# Altium schematic sheet Sheet1.SchDoc
size A3; SheetNumber: 3; SheetTotal: 3
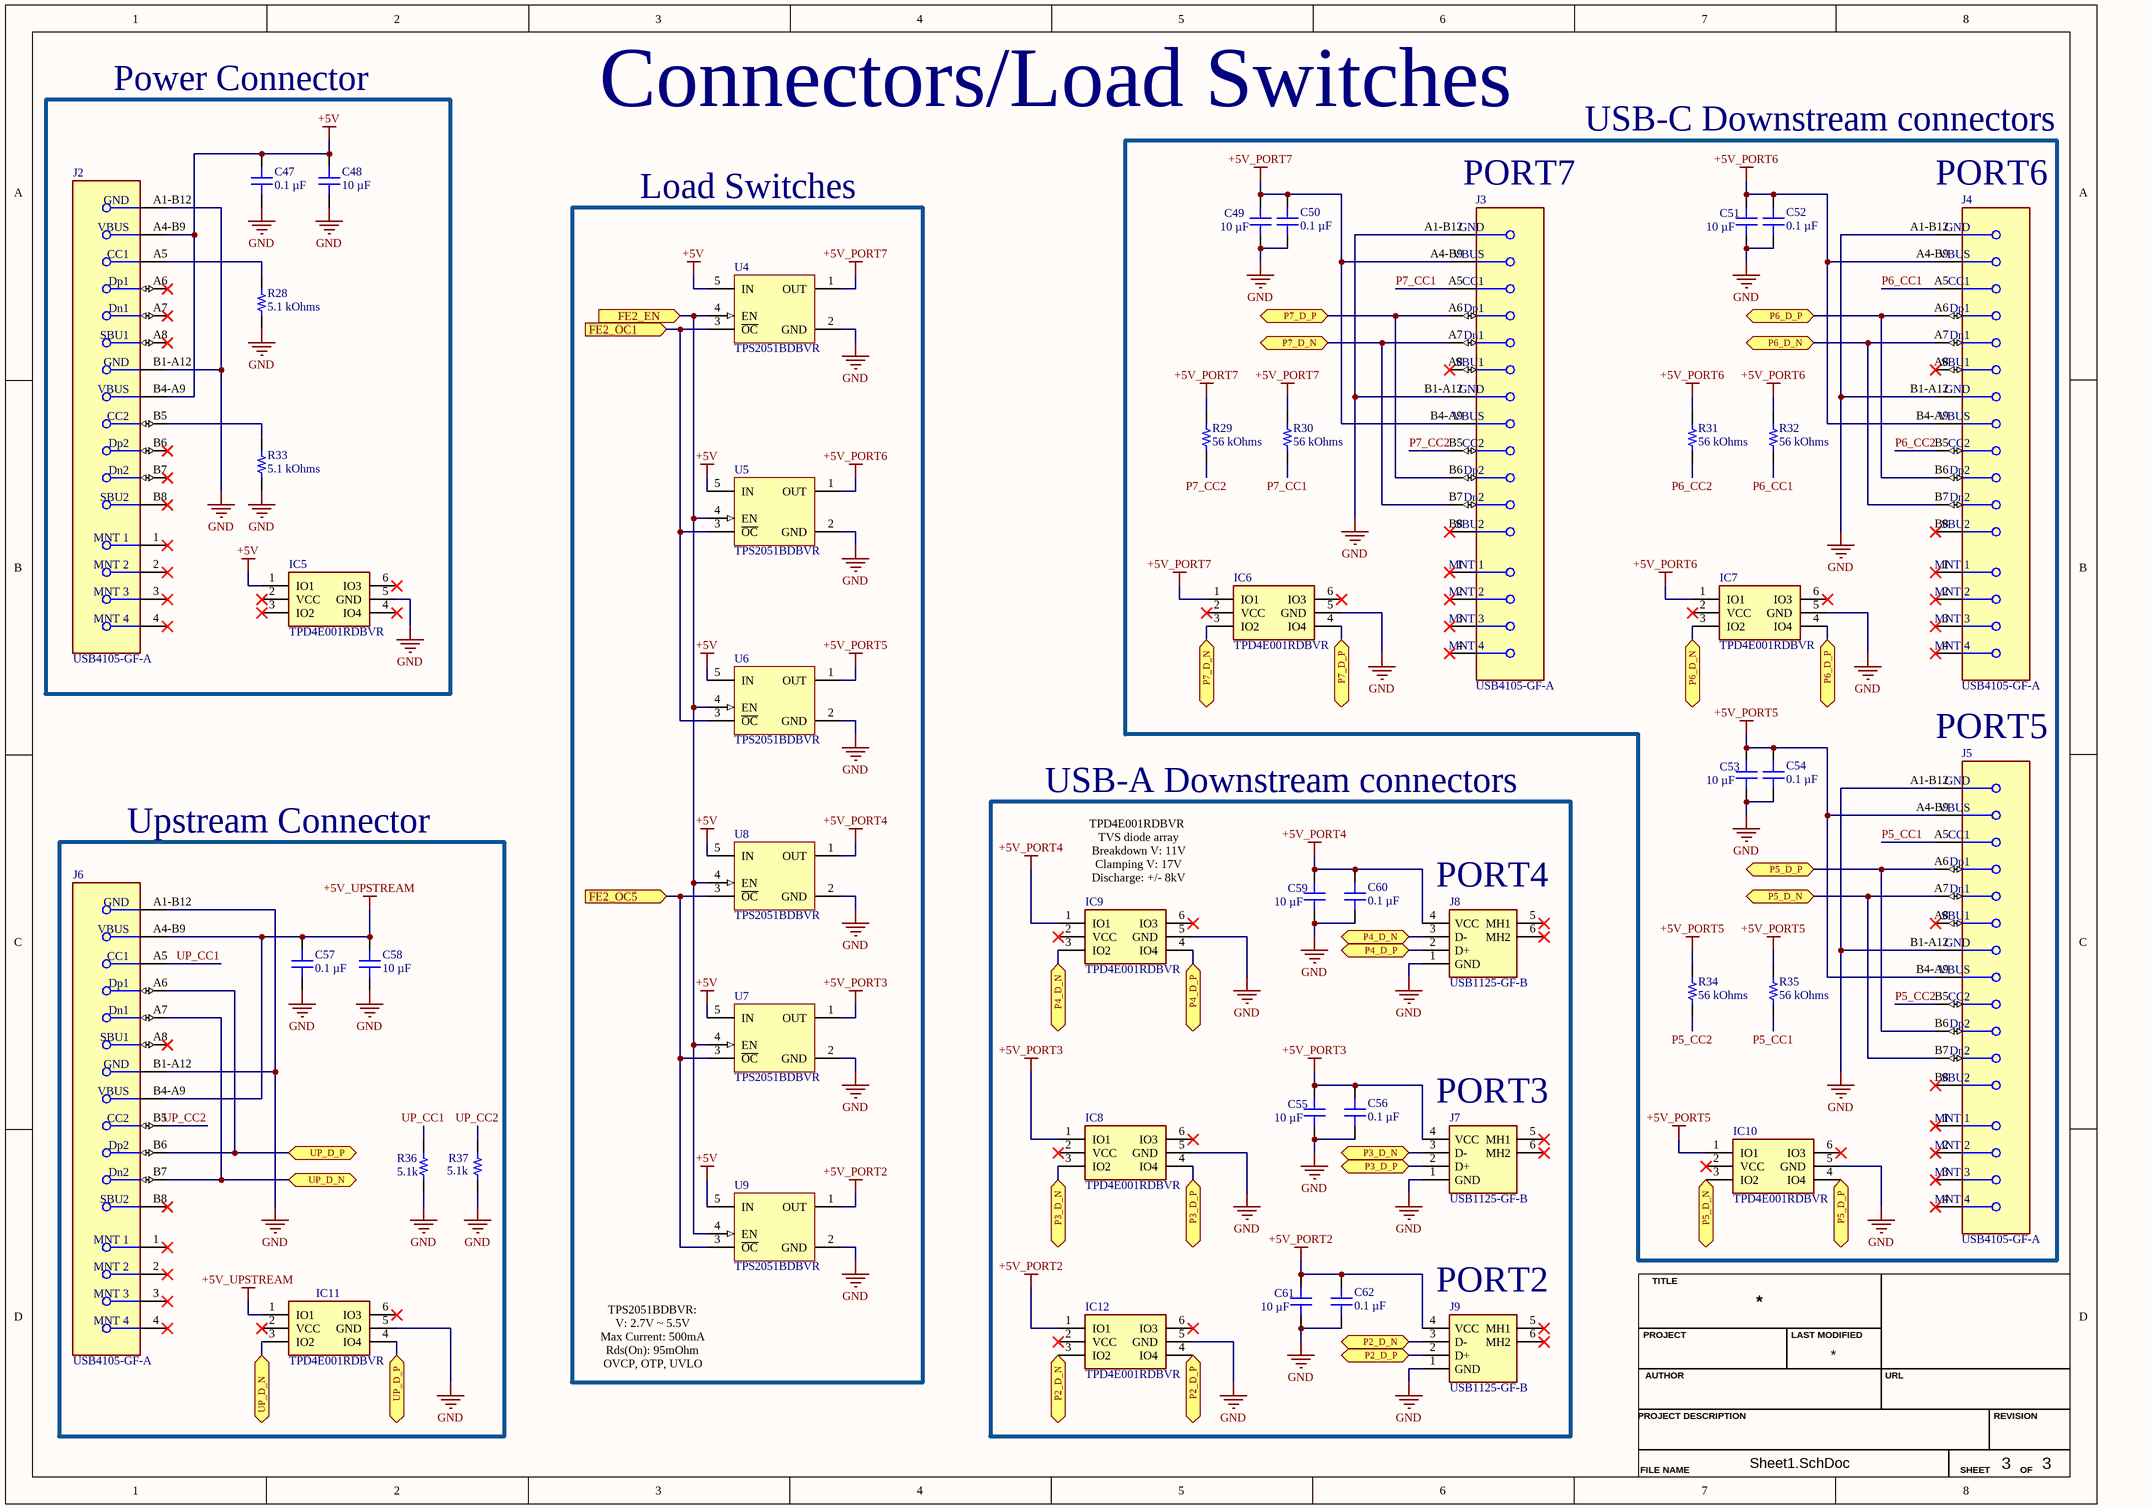
[diagram p0: Sheet1.SchDoc]

## Parts
C47  0.1 µF  [CAP 0603_1608]
C48  10 µF  [MURATA GRM21B 0805_2012]
C49  10 µF  [MURATA GRM21B 0805_2012]
C50  0.1 µF  [CAP 0603_1608]
C51  10 µF  [MURATA GRM21B 0805_2012]
C52  0.1 µF  [CAP 0603_1608]
C53  10 µF  [MURATA GRM21B 0805_2012]
C54  0.1 µF  [CAP 0603_1608]
C55  10 µF  [MURATA GRM21B 0805_2012]
C56  0.1 µF  [CAP 0603_1608]
C57  0.1 µF  [CAP 0603_1608]
C58  10 µF  [MURATA GRM21B 0805_2012]
C59  10 µF  [MURATA GRM21B 0805_2012]
C60  0.1 µF  [CAP 0603_1608]
C61  10 µF  [MURATA GRM21B 0805_2012]
C62  0.1 µF  [CAP 0603_1608]
IC5  TPD4E001RDBVR  [SOT95P280X145-6N]
IC6  TPD4E001RDBVR  [SOT95P280X145-6N]
IC7  TPD4E001RDBVR  [SOT95P280X145-6N]
IC8  TPD4E001RDBVR  [SOT95P280X145-6N]
IC9  TPD4E001RDBVR  [SOT95P280X145-6N]
IC10  TPD4E001RDBVR  [SOT95P280X145-6N]
IC11  TPD4E001RDBVR  [SOT95P280X145-6N]
IC12  TPD4E001RDBVR  [SOT95P280X145-6N]
J2  USB4105-GF-A  [FP-USB4105-GF-A-MFG]
J3  USB4105-GF-A  [FP-USB4105-GF-A-MFG]
J4  USB4105-GF-A  [FP-USB4105-GF-A-MFG]
J5  USB4105-GF-A  [FP-USB4105-GF-A-MFG]
J6  USB4105-GF-A  [FP-USB4105-GF-A-MFG]
J7  USB1125-GF-B  [USB1125GFB]
J8  USB1125-GF-B  [USB1125GFB]
J9  USB1125-GF-B  [USB1125GFB]
R28  5.1 kOhms  [KOA RES RK73 RN73 0603_1608]
R29  56 kOhms  [YAGEO RES 0603_1608]
R30  56 kOhms  [YAGEO RES 0603_1608]
R31  56 kOhms  [YAGEO RES 0603_1608]
R32  56 kOhms  [YAGEO RES 0603_1608]
R33  5.1 kOhms  [KOA RES RK73 RN73 0603_1608]
R34  56 kOhms  [YAGEO RES 0603_1608]
R35  56 kOhms  [YAGEO RES 0603_1608]
R36  5.1k  [KOA RES RK73 RN73 0603_1608]
R37  5.1k  [KOA RES RK73 RN73 0603_1608]
U4  TPS2051BDBVR  [DBV0005A_L]
U5  TPS2051BDBVR  [DBV0005A_L]
U6  TPS2051BDBVR  [DBV0005A_L]
U7  TPS2051BDBVR  [DBV0005A_L]
U8  TPS2051BDBVR  [DBV0005A_L]
U9  TPS2051BDBVR  [DBV0005A_L]

## Blocks framed on the sheet
Power Connector: C47 C48 IC5 J2 R28 R33
Load Switches: U4-U9
Upstream Connector: C57 C58 IC11 J6 R36 R37

## Ports
FE2_EN (in), FE2_OC1 (in), FE2_OC5 (in), P2_D_N (bidir), P2_D_P (bidir), P3_D_N (bidir), P3_D_P (bidir), P4_D_N (bidir), P4_D_P (bidir), P5_D_N (bidir), P5_D_P (bidir), P6_D_N (bidir), P6_D_P (bidir), P7_D_N (bidir), P7_D_P (bidir), UP_D_N (bidir), UP_D_P (bidir)

## Nets
+5V: C47.2 C48.2 IC5.1(IO1) J2.A4-B9(VBUS) J2.B4-A9(VBUS) U4.5(IN) U5.5(IN) U6.5(IN) U7.5(IN) U8.5(IN) U9.5(IN)
+5V_PORT2: C61.2 C62.2 IC12.1(IO1) J9.4(VCC) U9.1(OUT)
+5V_PORT3: C55.2 C56.2 IC8.1(IO1) J7.4(VCC) U7.1(OUT)
+5V_PORT4: C59.2 C60.2 IC9.1(IO1) J8.4(VCC) U8.1(OUT)
+5V_PORT5: C53.2 C54.2 IC10.1(IO1) J5.A4-B9(VBUS) J5.B4-A9(VBUS) R34.2 R35.2 U6.1(OUT)
+5V_PORT6: C51.2 C52.2 IC7.1(IO1) J4.A4-B9(VBUS) J4.B4-A9(VBUS) R31.2 R32.2 U5.1(OUT)
+5V_PORT7: C49.2 C50.2 IC6.1(IO1) J3.A4-B9(VBUS) J3.B4-A9(VBUS) R29.2 R30.2 U4.1(OUT)
+5V_UPSTREAM: C57.2 C58.2 IC11.1(IO1) J6.A4-B9(VBUS) J6.B4-A9(VBUS)
GND: C47.1 C48.1 C49.1 C50.1 C51.1 C52.1 C53.1 C54.1 C55.1 C56.1 C57.1 C58.1 C59.1 C60.1 C61.1 C62.1 IC5.5(GND) IC6.5(GND) IC7.5(GND) IC8.5(GND) IC9.5(GND) IC10.5(GND) IC11.5(GND) IC12.5(GND) J2.A1-B12(GND) J2.B1-A12(GND) J3.A1-B12(GND) J3.B1-A12(GND) J4.A1-B12(GND) J4.B1-A12(GND) J5.A1-B12(GND) J5.B1-A12(GND) J6.A1-B12(GND) J6.B1-A12(GND) J7.1(GND) J8.1(GND) J9.1(GND) R28.1 R33.1 R36.1 R37.1 U4.2(GND) U5.2(GND) U6.2(GND) U7.2(GND) U8.2(GND) U9.2(GND)
FE2_EN: U4.4(EN) U5.4(EN) U6.4(EN) U7.4(EN) U8.4(EN) U9.4(EN) ; port FE2_EN
FE2_OC1: U4.3(~{OC}) U5.3(~{OC}) U6.3(~{OC}) ; port FE2_OC1
FE2_OC5: U7.3(~{OC}) U8.3(~{OC}) U9.3(~{OC}) ; port FE2_OC5
P2_D_N: IC12.3(IO2) J9.3(D-) ; port P2_D_N
P2_D_P: IC12.4(IO4) J9.2(D+) ; port P2_D_P
P3_D_N: IC8.3(IO2) J7.3(D-) ; port P3_D_N
P3_D_P: IC8.4(IO4) J7.2(D+) ; port P3_D_P
P4_D_N: IC9.3(IO2) J8.3(D-) ; port P4_D_N
P4_D_P: IC9.4(IO4) J8.2(D+) ; port P4_D_P
P5_CC1: J5.A5(CC1) R35.1
P5_CC2: J5.B5(CC2) R34.1
P5_D_N: IC10.3(IO2) J5.A7(Dn1) J5.B7(Dn2) ; port P5_D_N
P5_D_P: IC10.4(IO4) J5.A6(Dp1) J5.B6(Dp2) ; port P5_D_P
P6_CC1: J4.A5(CC1) R32.1
P6_CC2: J4.B5(CC2) R31.1
P6_D_N: IC7.3(IO2) J4.A7(Dn1) J4.B7(Dn2) ; port P6_D_N
P6_D_P: IC7.4(IO4) J4.A6(Dp1) J4.B6(Dp2) ; port P6_D_P
P7_CC1: J3.A5(CC1) R30.1
P7_CC2: J3.B5(CC2) R29.1
P7_D_N: IC6.3(IO2) J3.A7(Dn1) J3.B7(Dn2) ; port P7_D_N
P7_D_P: IC6.4(IO4) J3.A6(Dp1) J3.B6(Dp2) ; port P7_D_P
UP_CC1: J6.A5(CC1) R36.2
UP_CC2: J6.B5(CC2) R37.2
UP_D_N: IC11.3(IO2) J6.A7(Dn1) J6.B7(Dn2) ; port UP_D_N
UP_D_P: IC11.4(IO4) J6.A6(Dp1) J6.B6(Dp2) ; port UP_D_P
NetJ2_A5: J2.A5(CC1) R28.2
NetJ2_B5: J2.B5(CC2) R33.2

Not connected (* = marked no-connect by the designer): IC5 2(VCC)* 3(IO2)* 4(IO4)* 6(IO3)*; IC6 2(VCC)* 6(IO3)*; IC7 2(VCC)* 6(IO3)*; IC8 2(VCC)* 6(IO3)*; IC9 2(VCC)* 6(IO3)*; IC10 2(VCC)* 6(IO3)*; IC11 2(VCC)* 6(IO3)*; IC12 2(VCC)* 6(IO3)*; J2 1(MNT_1)* 2(MNT_2)* 3(MNT_3)* 4(MNT_4)* A6(Dp1)* A7(Dn1)* A8(SBU1)* B6(Dp2)* B7(Dn2)* B8(SBU2)*; J3 1(MNT_1)* 2(MNT_2)* 3(MNT_3)* 4(MNT_4)* A8(SBU1)* B8(SBU2)*; J4 1(MNT_1)* 2(MNT_2)* 3(MNT_3)* 4(MNT_4)* A8(SBU1)* B8(SBU2)*; J5 1(MNT_1)* 2(MNT_2)* 3(MNT_3)* 4(MNT_4)* A8(SBU1)* B8(SBU2)*; J6 1(MNT_1)* 2(MNT_2)* 3(MNT_3)* 4(MNT_4)* A8(SBU1)* B8(SBU2)*; J7 5(MH1)* 6(MH2)*; J8 5(MH1)* 6(MH2)*; J9 5(MH1)* 6(MH2)*

## Notes on the sheet
- Connectors/Load Switches
- USB-C Downstream connectors
- (near J3) PORT7
- (near J4) PORT6
- PORT5
- USB-A Downstream connectors
- (near IC9) TPD4E001RDBVR
  TVS diode array
  Breakdown V: 11V
  Clamping V: 17V
  Discharge: +/- 8kV
- (near J8) PORT4
- (near J7) PORT3
- (near J9) PORT2
- TPS2051BDBVR:
  V: 2.7V ~ 5.5V
  Max Current: 500mA
  Rds(On): 95mOhm
  OVCP, OTP, UVLO
- TITLE
- AUTHOR
- PROJECT
- LAST MODIFIED
- URL
- PROJECT DESCRIPTION
- REVISION
- FILE NAME
- SHEET
- OF

## Library data of the parts
C47 C50 C52 C54 C56 C57 C60 C62 = GCJ188R71H104KA12D: CAP CER 0.1UF 50V X7R 0603; manufacturer: Murata Electronics; Tolerance: ±10%; Part Number: GCJ188R71H104KA12D; Capacitance: 0.1 µF; Applications: Automotive, Boardflex Sensitive; componentlink1description: Datasheet; componentlink1url: https://www.murata.com/~/media/webrenewal/support/library/catalog/products/capacitor/mlcc/c03e.ashx?la=en-us; componentlink2description: DigiKey Link; componentlink2url: https://www.digikey.com/en/products/detail/murata-electronics/GCJ188R71H104KA12D/2783803; Device Package: 0603 (1608 Metric); Features: Soft Termination; lastupdated: 2/9/2024 8:10:08 PM; Lifecycle Status: Active; Minimum Order: 1; Mounting Type: Surface Mount, MLCC; Operating Temperature: -55°C ~ 125°C; Package / Case: 0603 (1608 Metric); packaging: TapeAndReel; partid: 16867; Part Status: Active; price: 0.01; Ratings: AEC-Q200; series: GCJ; Size / Dimension: 0.063" L x 0.031" W (1.60mm x 0.80mm); Supplier 1: DigiKey; Supplier Part Number 1: 490-5798-1-ND; Temperature Coefficient: X7R; Thickness (Max): 0.035" (0.90mm); value: 0.1 µF; Voltage - Rated: 50V
C48 C49 C51 C53 C55 C58 C59 C61 = GRM21BR61E106KA73K: CAP CER 10UF 25V X5R 0805; manufacturer: Murata Electronics; Tolerance: ±10%; Part Number: GRM21BR61E106KA73K; Capacitance: 10 µF; Applications: General Purpose; componentlink1description: Datasheet; componentlink1url: https://search.murata.co.jp/Ceramy/image/img/A01X/G101/ENG/GRM21BR61E106KA73-01.pdf; componentlink2description: DigiKey Link; componentlink2url: https://www.digikey.com/en/products/detail/murata-electronics/GRM21BR61E106KA73K/4905532; Device Package: 0805 (2012 Metric); lastupdated: 8/27/2024 9:29:55 AM; Lifecycle Status: Active; Minimum Order: 1; Mounting Type: Surface Mount, MLCC; Operating Temperature: -55°C ~ 85°C; Package / Case: 0805 (2012 Metric); packaging: TapeAndReel; partid: 15140; Part Status: Active; price: 0.02; series: GRM; Size / Dimension: 0.079" L x 0.049" W (2.00mm x 1.25mm); Supplier 1: DigiKey; Supplier Part Number 1: 490-16824-1-ND; Temperature Coefficient: X5R; Thickness (Max): 0.055" (1.40mm); value: 10 µF; Voltage - Rated: 25V
IC5-IC12 = TPD4E001RDBVR: Integrated Circuit; Manufacturer_Name: Texas Instruments; Datasheet Link: http://www.ti.com/lit/gpn/TPD4E001; Height: 1.45mm; Manufacturer_Part_Number: TPD4E001RDBVR; Mouser Part Number: 595-TPD4E001RDBVR; Mouser Price/Stock: https://www.mouser.co.uk/ProductDetail/Texas-Instruments/TPD4E001RDBVR?qs=P1JMDcb91o7xMbcYcXI1uw%3D%3D; Arrow Part Number: TPD4E001RDBVR; Arrow Price/Stock: https://www.arrow.com/en/products/tpd4e001rdbvr/texas-instruments?utm_currency=USD&region=nac
J2-J6 = CMP-002-00071-1: Conn USB 2.0 Type C RCP 24 POS 0.3mm/0.5mm Solder RA SMD 24 Terminal 1 Port T/R
J7-J9 = USB1125-GF-B: Connector; Manufacturer_Name: GCT (GLOBAL CONNECTOR TECHNOLOGY); Datasheet Link: https://gct.co/Files/Drawings/USB1125.pdf?v=4becdda1-cc62-4082-a121-52fbd8b9794d; Height: 6.63mm; Manufacturer_Part_Number: USB1125-GF-B; Mouser Part Number: 640-USB1125-GF-B; Mouser Price/Stock: https://www.mouser.co.uk/ProductDetail/GCT/USB1125-GF-B?qs=KUoIvG%2F9IlbMrLtAEIp0gA%3D%3D
R28 R33 = RK73B1JTTDD512J: RESISTOR; Manufacturer: KOA Speer Electronics, Inc.; Power (Watts): 0.1W, 1/10W; Temperature Coefficient: ±200ppm/°C; Tolerance: ±5%; Part Number: RK73B1JTTDD512J; Value: 5.1 kOhms; ComponentLink1Description: Datasheet; ComponentLink1URL: https://www.koaspeer.com/pdfs/RK73B.pdf; ComponentLink2Description: DigiKey Link; ComponentLink2URL: https://www.digikey.com/en/products/detail/koa-speer-electronics-inc/RK73B1JTTDD512J/21680160; Composition: Thick Film; Device Package: 0603 (1608 Metric); Features: Automotive AEC-Q200; Height - Seated (Max): 0.022" (0.55mm); LastUpdated: 7/25/2024 9:42:51 AM; Lifecycle Status: Active; Minimum Order: 1; Number of Terminations: 2; Operating Temperature: -55°C ~ 155°C; Package / Case: 0603 (1608 Metric); Packaging: CutTape; PartId: 89828; Price: 0.01; Ratings: AEC-Q200; Resistance: 5.1 kOhms; Series: RK73B; Size / Dimension: 0.063" L x 0.031" W (1.60mm x 0.80mm); Supplier 1: DigiKey; Supplier Part Number 1: 2019-RK73B1JTTDD512JCT-ND; Supplier Device Package: 0603
R29-R32 R34 R35 = RC0603JR-0756KL: RES 56K OHM 5% 1/10W 0603; Manufacturer: Yageo; Power (Watts): 0.1W, 1/10W; Temperature Coefficient: ±100ppm/°C; Part Number: RC0603JR-0756KL; Value: 56 kOhms; ComponentLink1Description: Datasheet; ComponentLink1URL: https://www.yageo.com/upload/media/product/productsearch/datasheet/rchip/PYu-RC_Group_51_RoHS_L_10.pdf; ComponentLink2Description: DigiKey Link; ComponentLink2URL: https://www.digikey.com/en/products/detail/yageo/RC0603JR-0756KL/726808; Composition: Thick Film; Device Package: 0603 (1608 Metric); Features: Moisture Resistant; Height - Seated (Max): 0.022" (0.55mm); LastUpdated: 7/25/2024 9:19:24 AM; Lifecycle Status: Active; Minimum Order: 1; Number of Terminations: 2; Operating Temperature: -55°C ~ 155°C; Package / Case: 0603 (1608 Metric); Packaging: CutTape; PartId: 17226; Part Status: Active; Price: 0.01; Resistance: 56 kOhms; Series: RC_L; Size / Dimension: 0.063" L x 0.031" W (1.60mm x 0.80mm); Supplier 1: DigiKey; Supplier Part Number 1: 311-56KGRCT-ND; Supplier Device Package: 0603; Tolerance: ±5%
R36 R37 = RK73B1JTTDD512J: RESISTOR; Manufacturer: KOA Speer Electronics, Inc.; Power (Watts): 0.1W, 1/10W; Resistance: 5.1 kOhms; Temperature Coefficient: ±200ppm/°C; Tolerance: ±5%; Part Number: RK73B1JTTDD512J; Value: 5.1k; ComponentLink1Description: Datasheet; ComponentLink1URL: https://www.koaspeer.com/pdfs/RK73B.pdf; ComponentLink2Description: DigiKey Link; ComponentLink2URL: https://www.digikey.com/en/products/detail/koa-speer-electronics-inc/RK73B1JTTDD512J/21680160; Composition: Thick Film; Device Package: 0603 (1608 Metric); Features: Automotive AEC-Q200; Height - Seated (Max): 0.022" (0.55mm); LastUpdated: 7/25/2024 9:42:51 AM; Lifecycle Status: Active; Minimum Order: 1; Number of Terminations: 2; Operating Temperature: -55°C ~ 155°C; Package / Case: 0603 (1608 Metric); Packaging: CutTape; PartId: 89828; Price: 0.01; Ratings: AEC-Q200; Series: RK73B; Size / Dimension: 0.063" L x 0.031" W (1.60mm x 0.80mm); Supplier 1: DigiKey; Supplier Part Number 1: 2019-RK73B1JTTDD512JCT-ND; Supplier Device Package: 0603
U4-U9 = CMP-019-00060-1: 0.5A loading, 2.7-5.5V, 70mΩ USB power switch, active-high 5-SOT-23 -40 to 125; Output Voltage: 6V; Max Supply Voltage: 5.5V; Max Power Dissipation: 285mW; Min Supply Voltage: 2.7V; Output Current: 500mA; Pins: 5; Mounting Technology: Surface Mount; Case/Package: SOT-23; Min Operating Temperature: -40°C; Max Operating Temperature: 85°C